# Altium schematic sheet Inverter_Power.SchDoc
size A4
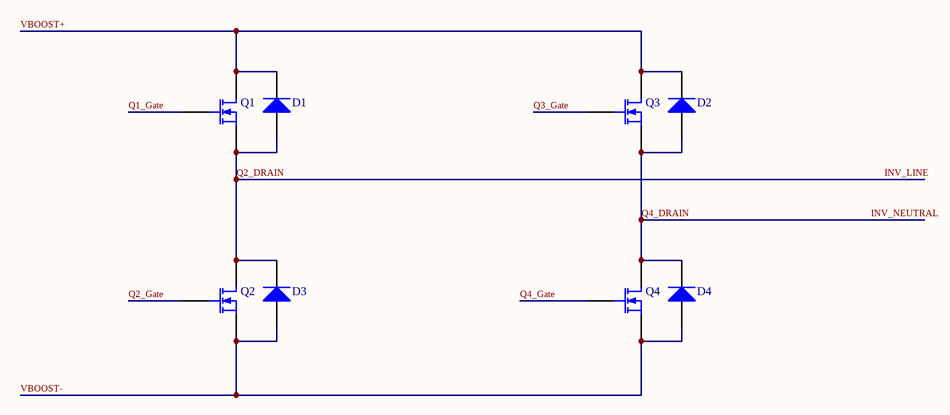
[diagram p0: Inverter_Power.SchDoc]

## Parts
D1  Diode  [SMC]  (value not drawn)
D2  Diode  [SMC]  (value not drawn)
D3  Diode  [SMC]  (value not drawn)
D4  Diode  [SMC]  (value not drawn)
Q1  MOSFET-N  [E3]  (value not drawn)
Q2  MOSFET-N  [E3]  (value not drawn)
Q3  MOSFET-N  [E3]  (value not drawn)
Q4  MOSFET-N  [E3]  (value not drawn)

## Nets
INV_LINE: D1.1(A) D3.2(K) Q1.3(S) Q2.1(D)  [also labelled Q2_DRAIN]
INV_NEUTRAL: D2.1(A) D4.2(K) Q3.3(S) Q4.1(D)  [also labelled Q4_DRAIN]
Q1_Gate: Q1.2(G)
Q2_Gate: Q2.2(G)
Q3_Gate: Q3.2(G)
Q4_Gate: Q4.2(G)
VBOOST+: D1.2(K) D2.2(K) Q1.1(D) Q3.1(D)
VBOOST-: D3.1(A) D4.1(A) Q2.3(S) Q4.3(S)

## Library data of the parts
D1-D4 = Diode: Default Diode; Published: 8-Jun-2000; LatestRevisionDate: 17-Jul-2002; LatestRevisionNote: Re-released for DXP Platform.; PackageVersion: Sep-1996; PackageReference: SMC; Publisher: Altium Limited; PackageDescription: DO-214-AB/SMC; 2 C-Bend Leads; Body 7.9 x 5.9 mm, inc. leads (LxW); Code_JEDEC: DO-214-AB
Q1-Q4 = MOSFET-N: N-Channel MOSFET; Published: 8-Jun-2000; LatestRevisionDate: 17-Jul-2002; LatestRevisionNote: Re-released for DXP Platform.; PackageVersion: 1995/1996; PackageReference: E3; Publisher: Altium Limited; PackageDescription: TO, Flat Index; 3 In-Line, Axial Leads; Body Dia. 4.6mm; Lead Dia. 0.5 mm (max)